# EAGLE schematic oven-controller-v0 (EAGLE 6.4)
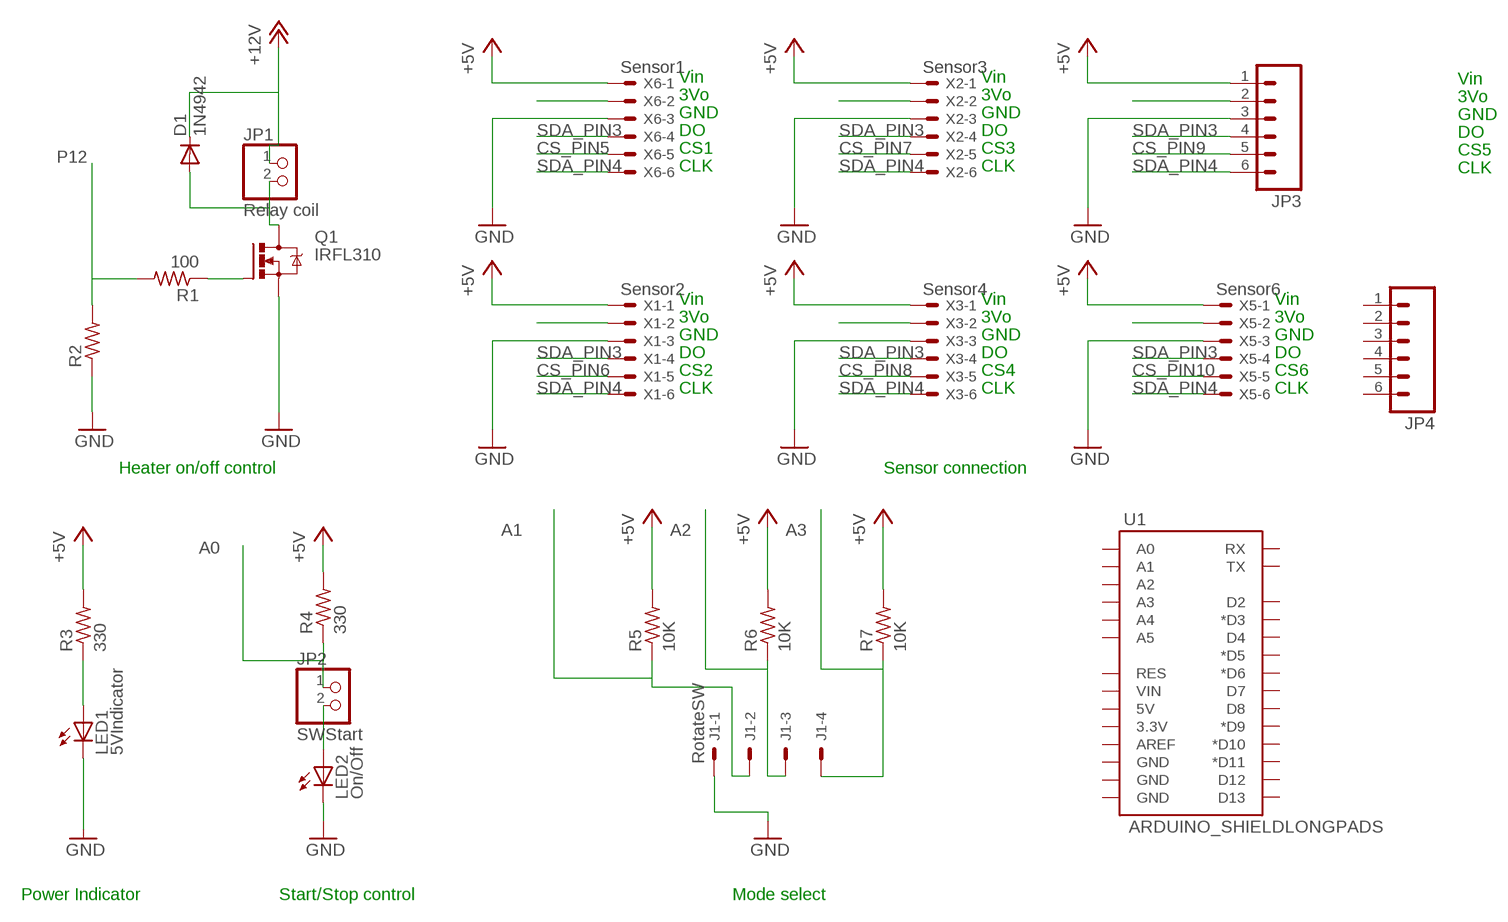
[diagram p0: schematic, sheet 1]

## Parts
D1  1N4942  [DO41-10]
J1  RotateSW  22-27-2041-04  [6410-04]
JP1  Relay coil  PINHD-1X2  [1X02]
JP2  SWStart  PINHD-1X2  [1X02]
JP3  M06LOCK_LONGPADS  [1X06_LOCK_LONGPADS]
JP4  M06LOCK_LONGPADS  [1X06_LOCK_LONGPADS]
LED1  5VIndicator  LED5MM  [LED5MM]
LED2  On/Off  LED5MM  [LED5MM]
Q1  IRFL310  IRF520  [TO220BV]
R1  100  R-US_V234/12  [V234/12]
R2  R-US_V234/12  [V234/12]
R3  330  R-US_0207/10  [0207/10]
R4  330  R-US_0207/10  [0207/10]
R5  10K  R-US_0207/10  [0207/10]
R6  10K  R-US_0207/10  [0207/10]
R7  10K  R-US_0207/10  [0207/10]
U1  ARDUINO_SHIELDLONGPADS  [DUEMILANOVE_SHIELD_LONGPADS]
X1  Sensor2  22-23-2061  [22-23-2061]
X2  Sensor3  22-23-2061  [22-23-2061]
X3  Sensor4  22-23-2061  [22-23-2061]
X5  Sensor6  22-23-2061  [22-23-2061]
X6  Sensor1  22-23-2061  [22-23-2061]

## Nets
+5V: JP3.1 R3.2 R4.2 R5.2 R6.2 R7.2 X1.1 X2.1 X3.1 X5.1 X6.1
A0: JP2.1 R4.1
A1: J1.2 R5.1
A2: J1.3 R6.1
A3: J1.4 R7.1
CS_PIN5: X6.5
CS_PIN6: X1.5
CS_PIN7: X2.5
CS_PIN8: X3.5
CS_PIN9: JP3.5
CS_PIN10: X5.5
GND: J1.1 JP3.3 LED2.K(C) Q1.S R2.1 X1.3 X2.3 X3.3 X5.3 X6.3
N$1: X1.2
N$2: Q1.G R1.1
N$3: D1.A JP1.2 Q1.D
N$4: X6.2
N$5: X2.2
N$6: X3.2
N$7: D1.C JP1.1
N$8: JP3.2
N$9: X5.2
N$10: JP2.2 LED2.A
N$11: LED1.A R3.1
N$12: LED1.K(C)
P12: R1.2 R2.2
SDA_PIN3: JP3.4 X1.4 X2.4 X3.4 X5.4 X6.4
SDA_PIN4: JP3.6 X1.6 X2.6 X3.6 X5.6 X6.6
Unconnected: JP4.1 JP4.2 JP4.3 JP4.4 JP4.5 JP4.6 U1.3.3V U1.5V U1.A0 U1.A1 U1.A2 U1.A3 U1.A4 U1.A5 U1.AREF U1.D2 U1.D3(*D3) U1.D4 U1.D5(*D5) U1.D6(*D6) U1.D7 U1.D8 U1.D9(*D9) U1.D10(*D10) U1.D11(*D11) U1.D12 U1.D13 U1.GND@0(GND) U1.GND@1(GND) U1.GND@2(GND) U1.RES U1.RX U1.TX U1.VIN

## Notes on the sheet
- Vin | Vin | Vin
- 3Vo | 3Vo | 3Vo
- GND | GND | GND
- DO | DO | DO
- CS1 | CS3 | CS5
- CLK | CLK | CLK
- Vin | Vin | Vin
- 3Vo | 3Vo | 3Vo
- GND | GND | GND
- DO | DO | DO
- CS2 | CS4 | CS6
- CLK | CLK | CLK
- Heater on/off control | Sensor connection
- Power Indicator | Start/Stop control | Mode select

## Library data of the parts
D1 = diode:1N4942: DIODE 1.0 A, 200 V, 150 ns
J1 = con-molex:22-?-04: CONNECTOR wire to board 2.54 mm (.1 inch) pitch header; OC_FARNELL: unknown; OC_NEWARK: unknown
JP1 JP2 = pinhead:PINHD-1X2: PIN HEADER
JP3 JP4 = SparkFun-Connectors:M06: Header 6 Standard 6-pin 0.1" header. Use with straight break away headers (SKU : PRT-00116), right angle break away headers (PRT-00553), swiss pins (PRT-00743), machine pins (PRT-00117), and female headers (PRT-00115). Molex polarized connector foot print use with SKU : PRT-08094 with associated crimp pins and housings. NOTES ON THE VARIANTS LOCK and LOCK_LONGPADS... This footprint was designed to help hold the alignment of a through-hole component (i.e. 6-pin header) while soldering it into place. You may notice that each hole has been shifted either up or down by 0.005 of an inch from it's more standard position (which is a perfectly straight line). This slight alteration caused the pins (the squares in the middle) to touch the edges of the holes. Because they are alternating, it causes a "brace" to hold the component in place. 0.005 has proven to be the perfect amount of "off-center" position when using our standard breakaway headers. Although looks a little odd when you look at the bare footprint, once you have a header in there, the alteration is very hard to notice. Also, if you push a header all the way into place, it is covered up entirely on the bottom side. This idea of altering the position of holes to aid alignment will be further integrated into the Sparkfun Library for other footprints. It can help hold any component with 3 or more connection pins.
LED1 LED2 = led:LED: LED OSRAM: - CHIPLED LG R971, LG N971, LY N971, LG Q971, LY Q971, LO R971, LY R971 LH N974, LH R974 LS Q976, LO Q976, LY Q976 LO Q996 - Hyper CHIPLED LW Q18S LB Q993, LB Q99A, LB R99A - SideLED LS A670, LO A670, LY A670, LG A670, LP A670 LB A673, LV A673, LT A673, LW A673 LH A674 LY A675 LS A676, LA A676, LO A676, LY A676, LW A676 LS A679, LY A679, LG A679 - Hyper Micro SIDELED® LS Y876, LA Y876, LO Y876, LY Y876 LT Y87S - SmartLED LW L88C, LW L88S LB L89C, LB L89S, LG L890 LS L89K, LO L89K, LY L89K LS L896, LA L896, LO L896, LY L896 - TOPLED LS T670, LO T670, LY T670, LG T670, LP T670 LSG T670, LSP T670, LSY T670, LOP T670, LYG T670 LG T671, LOG T671, LSG T671 LB T673, LV T673, LT T673, LW T673 LH T674 LS T676, LA T676, LO T676, LY T676, LB T676, LH T676, LSB T676, LW T676 LB T67C, LV T67C, LT T67C, LS T67K, LO T67K, LY T67K, LW E67C LS E67B, LA E67B, LO E67B, LY E67B, LB E67C, LV E67C, LT E67C LW T67C LS T679, LY T679, LG T679 LS T770, LO T770, LY T770, LG T770, LP T770 LB T773, LV T773, LT T773, LW T773 LH T774 LS E675, LA E675, LY E675, LS T675 LS T776, LA T776, LO T776, LY T776, LB T776 LHGB T686 LT T68C, LB T68C - Hyper Mini TOPLED® LB M676 - Mini TOPLED Santana® LG M470 LS M47K, LO M47K, LY M47K Source: http://www.osram.convergy.de LUXEON: - LUMILED® LXK2-PW12-R00, LXK2-PW12-S00, LXK2-PW14-U00, LXK2-PW14-V00 LXK2-PM12-R00, LXK2-PM12-S00, LXK2-PM14-U00 LXK2-PE12-Q00, LXK2-PE12-R00, LXK2-PE12-S00, LXK2-PE14-T00, LXK2-PE14-U00 LXK2-PB12-K00, LXK2-PB12-L00, LXK2-PB12-M00, LXK2-PB14-N00, LXK2-PB14-P00, LXK2-PB14-Q00 LXK2-PR12-L00, LXK2-PR12-M00, LXK2-PR14-Q00, LXK2-PR14-R00 LXK2-PD12-Q00, LXK2-PD12-R00, LXK2-PD12-S00 LXK2-PH12-R00, LXK2-PH12-S00 LXK2-PL12-P00, LXK2-PL12-Q00, LXK2-PL12-R00 Source: www.luxeon.com KINGBRIGHT: KA-3528ASYC Source: www.kingbright.com
Q1 = transistor-power:IRF520: HEXFET Power MOSFET
R1-R7 = resistor:R-US_: RESISTOR, American symbol
U1 = SparkFun-Boards:ARDUINO_SHIELD: Arduino shield footprint
X1-X3 X5 X6 = con-molex:22-23-2061: .100" (2.54mm) Center Header - 6 Pin; MF: MOLEX; MPN: 22-23-2061; OC_FARNELL: 1462922; OC_NEWARK: 27C1933